# Altium schematic sheet Cameron's Edits.SchDoc: NER A Size Template
size Tabloid; ApprovedBy: WS; DrawnBy: Cameron Gordon & Elise Cooke; Address4: X.X.X; Revision: 1; SheetNumber: 2; SheetTotal: 3
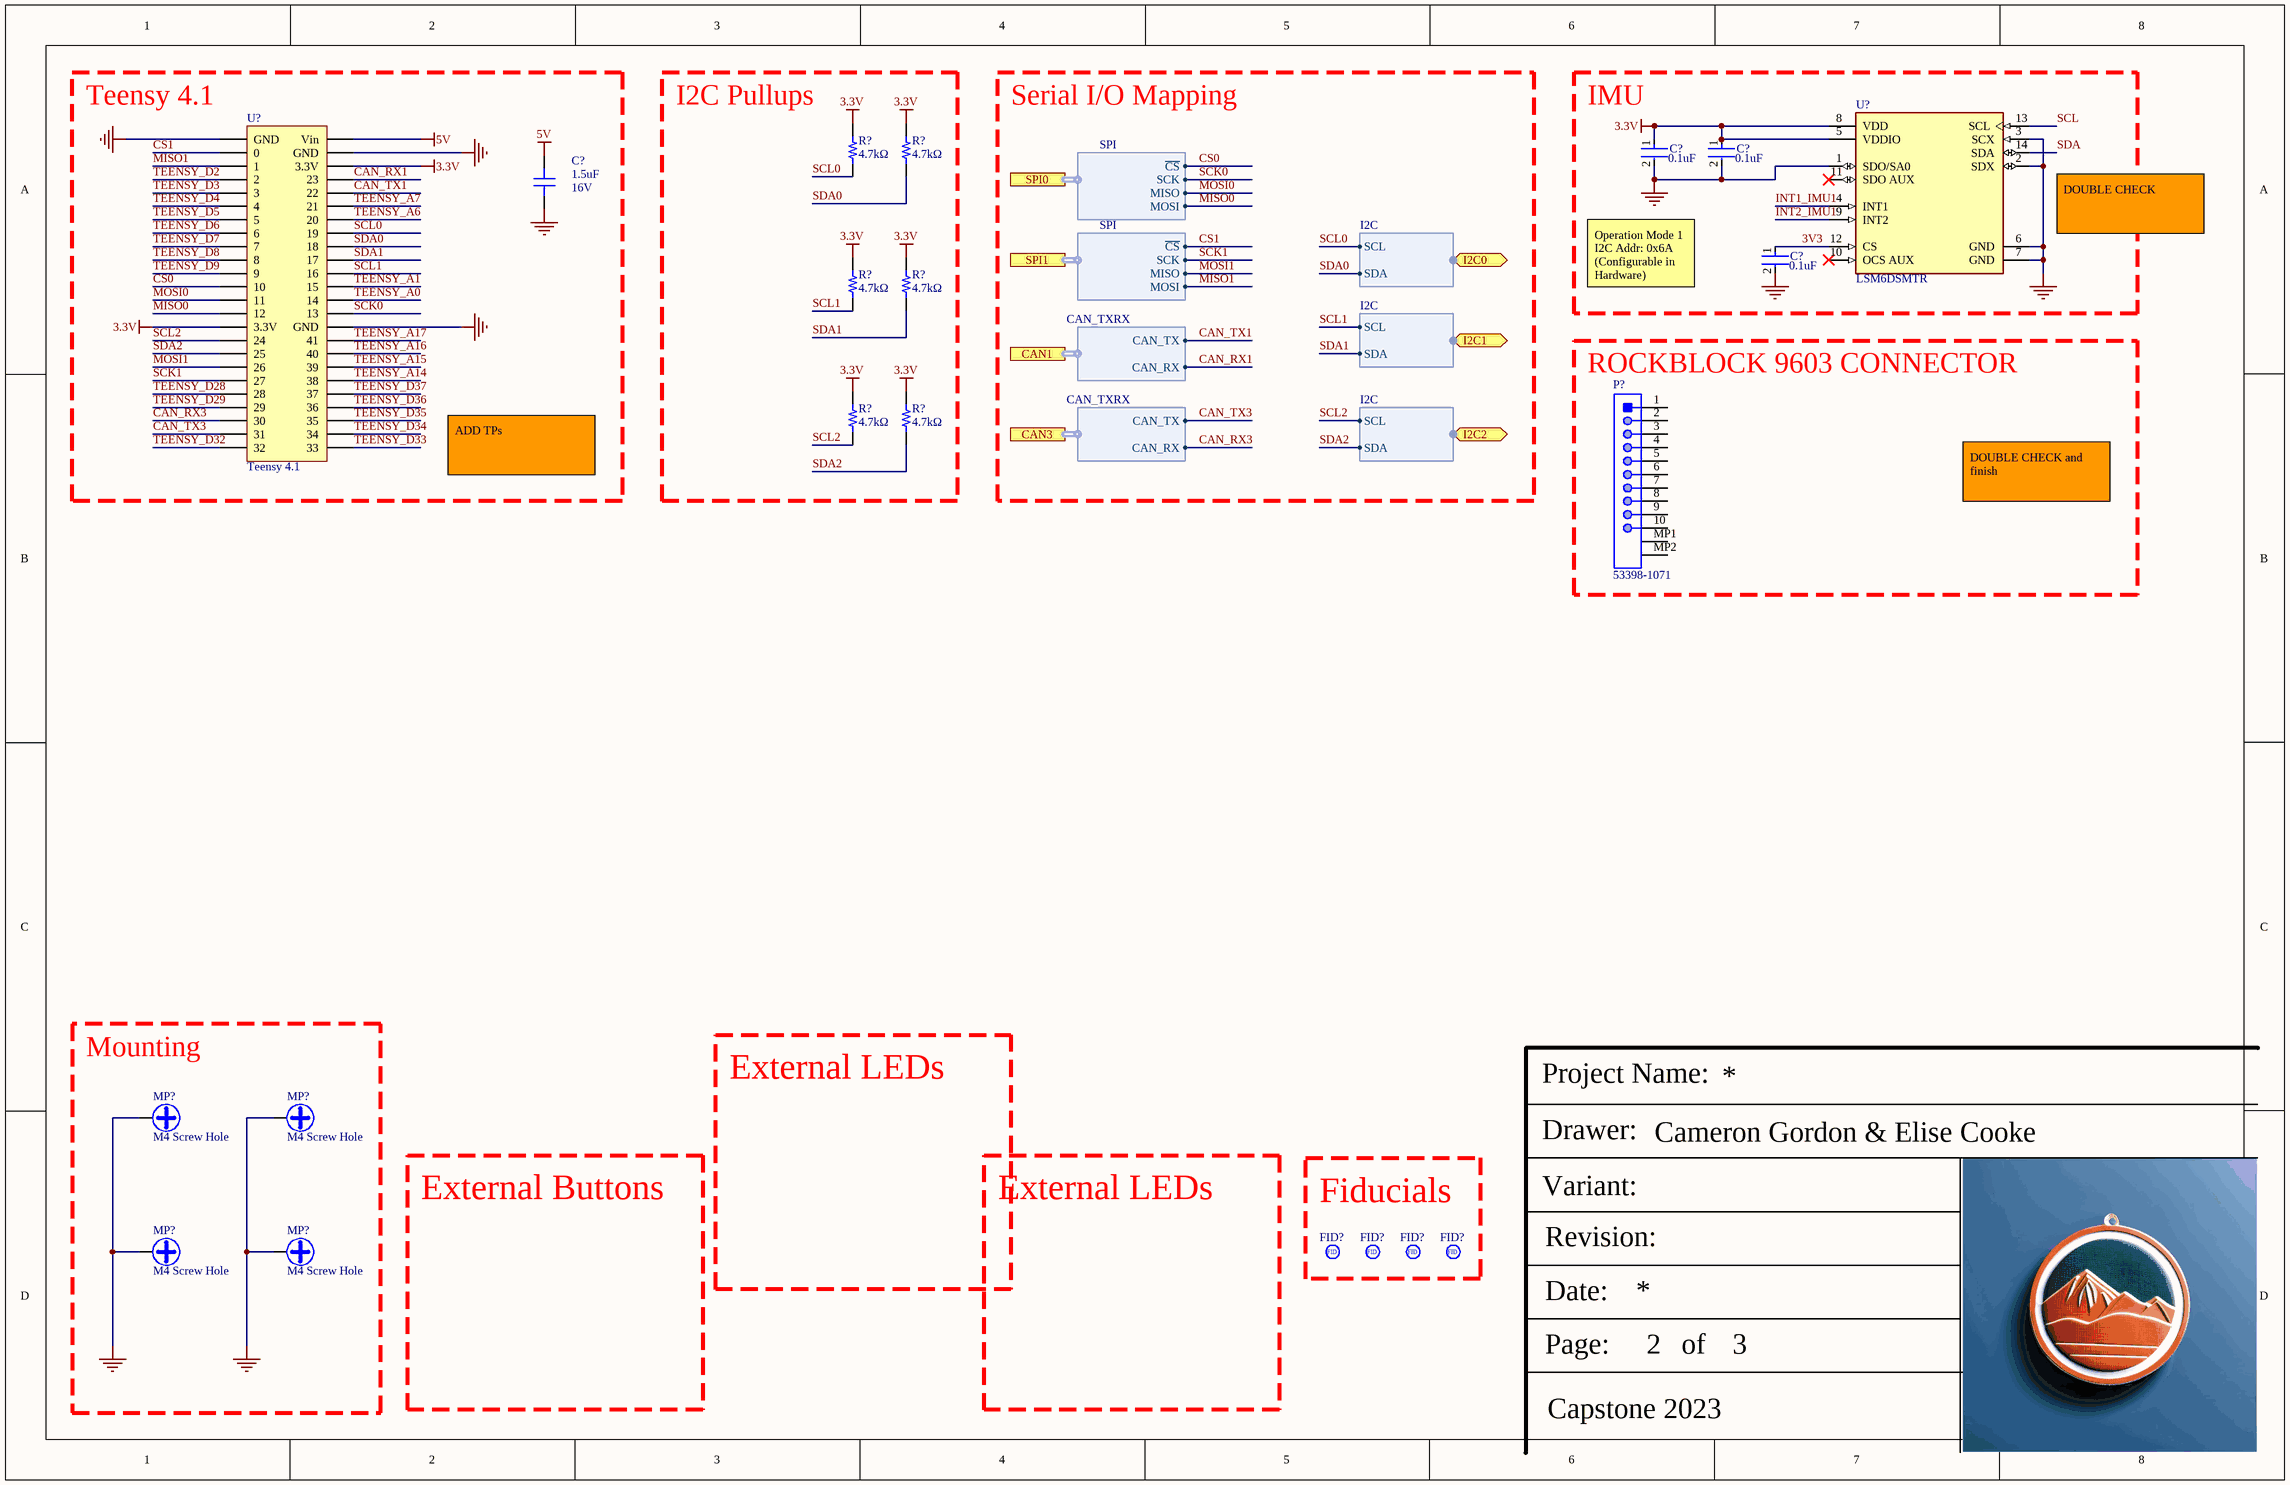
[diagram p0: Cameron's Edits.SchDoc]

## Parts
(Parts that share a designator on the sheet are numbered #1, #2 ... from top to bottom, then left to right.)
C?#1  Capacitance: 0.1uF  [FP-CL278-IPC_C]  (hidden comment: CL05A104KA5NNNC)
C?#2  Capacitance: 0.1uF  [FP-CL278-IPC_C]  (hidden comment: CL05A104KA5NNNC)
C?#3  Capacitance: 1.5uF  Voltage Rating: 16V  [0805 Ceramic Capacitor]  (hidden comment: GCM21BR71C155KA37L)
C?#4  Capacitance: 0.1uF  [FP-CL278-IPC_C]  (hidden comment: CL05A104KA5NNNC)
FID?#1  Fiducial  [40 mil Circular Test Point]  (value not drawn)
FID?#2  Fiducial  [40 mil Circular Test Point]  (value not drawn)
FID?#3  Fiducial  [40 mil Circular Test Point]  (value not drawn)
FID?#4  Fiducial  [40 mil Circular Test Point]  (value not drawn)
MP?#1  M4 Screw Hole  [New footprint 1]
MP?#2  M4 Screw Hole  [New footprint 1]
MP?#3  M4 Screw Hole  [New footprint 1]
MP?#4  M4 Screw Hole  [New footprint 1]
P?  53398-1071  [MOLX-53398-1071_V]
R?#1  Resistance: 4.7kΩ  [0603 Resistor]  (hidden comment: ERJ-3GEYJ472V)
R?#2  Resistance: 4.7kΩ  [0603 Resistor]  (hidden comment: ERJ-3GEYJ472V)
R?#3  Resistance: 4.7kΩ  [0603 Resistor]  (hidden comment: ERJ-3GEYJ472V)
R?#4  Resistance: 4.7kΩ  [0603 Resistor]  (hidden comment: ERJ-3GEYJ472V)
R?#5  Resistance: 4.7kΩ  [0603 Resistor]  (hidden comment: ERJ-3GEYJ472V)
R?#6  Resistance: 4.7kΩ  [0603 Resistor]  (hidden comment: ERJ-3GEYJ472V)
U?#1  LSM6DSMTR  [FP-LGA-14L-DM00249496-MFG]
U?#2  Teensy 4.1  [Teensy_4.1]

## Blocks framed on the sheet
Teensy 4.1: C?#3 U?#2
I2C Pullups: R?#1-R?#6
IMU: C?#1 C?#2 C?#4 U?#1
ROCKBLOCK 9603 CONNECTOR: P?
Mounting: MP?#1-MP?#4
Fiducials: FID?#1-FID?#4

## Ports
CAN1 (harness CAN_TXRX), CAN3 (harness CAN_TXRX), I2C0 (bidir, harness I2C), I2C1 (bidir, harness I2C), I2C2 (bidir, harness I2C), SPI0 (harness SPI), SPI1 (harness SPI)

## Harnesses
SPI: MOSI, MISO, ~{CS}, SCK
CAN_TXRX: CAN_TX, CAN_RX
I2C: SCL, SDA

## Nets
3.3V: C?#1.1 C?#2.1 R?#1.2 R?#2.2 R?#3.2 R?#4.2 R?#5.2 R?#6.2 U?#1.5(VDDIO) U?#1.8(VDD) U?#2.15(3.3V) U?#2.46(3.3V)
5V: C?#3.2 U?#2.48(Vin)
GND: C?#1.2 C?#2.2 C?#3.1 C?#4.2 MP?#1.1 MP?#2.1 MP?#3.1 MP?#4.1 U?#1.1(SDO/SA0) U?#1.2(SDX) U?#1.3(SCX) U?#1.6(GND) U?#1.7(GND) U?#2.1(GND) U?#2.34(GND) U?#2.47(GND)
3V3: C?#4.1 U?#1.12(CS)
CAN_RX1: U?#2.45(23) ; port CAN1.CAN_RX
CAN_RX3: U?#2.22(30) ; port CAN3.CAN_RX
CAN_TX1: U?#2.44(22) ; port CAN1.CAN_TX
CAN_TX3: U?#2.23(31) ; port CAN3.CAN_TX
CS0: U?#2.12(10) ; port SPI0.~{CS}
CS1: U?#2.2(0) ; port SPI1.~{CS}
INT1_IMU1: U?#1.4(INT1)
INT2_IMU1: U?#1.9(INT2)
MISO0: U?#2.14(12) ; port SPI0.MOSI
MISO1: U?#2.3(1) ; port SPI1.MOSI
MOSI0: U?#2.13(11) ; port SPI0.MISO
MOSI1: U?#2.18(26) ; port SPI1.MISO
SCK0: U?#2.35(13) ; port SPI0.SCK
SCK1: U?#2.19(27) ; port SPI1.SCK
SCL: U?#1.13(SCL)
SCL0: R?#1.1 U?#2.41(19) ; port I2C0.SCL
SCL1: R?#3.1 U?#2.38(16) ; port I2C1.SCL
SCL2: R?#5.1 U?#2.16(24) ; port I2C2.SCL
SDA: U?#1.14(SDA)
SDA0: R?#2.1 U?#2.40(18) ; port I2C0.SDA
SDA1: R?#4.1 U?#2.39(17) ; port I2C1.SDA
SDA2: R?#6.1 U?#2.17(25) ; port I2C2.SDA
TEENSY_A0: U?#2.36(14)
TEENSY_A1: U?#2.37(15)
TEENSY_A6: U?#2.42(20)
TEENSY_A7: U?#2.43(21)
TEENSY_A14: U?#2.30(38)
TEENSY_A15: U?#2.31(39)
TEENSY_A16: U?#2.32(40)
TEENSY_A17: U?#2.33(41)
TEENSY_D2: U?#2.4(2)
TEENSY_D3: U?#2.5(3)
TEENSY_D4: U?#2.6(4)
TEENSY_D5: U?#2.7(5)
TEENSY_D6: U?#2.8(6)
TEENSY_D7: U?#2.9(7)
TEENSY_D8: U?#2.10(8)
TEENSY_D9: U?#2.11(9)
TEENSY_D28: U?#2.20(28)
TEENSY_D29: U?#2.21(29)
TEENSY_D32: U?#2.24(32)
TEENSY_D33: U?#2.25(33)
TEENSY_D34: U?#2.26(34)
TEENSY_D35: U?#2.27(35)
TEENSY_D36: U?#2.28(36)
TEENSY_D37: U?#2.29(37)

Not connected (* = marked no-connect by the designer): P? 1 2 3 4 5 6 7 8 9 10 MP1 MP2; U?#1 10(OCS_AUX)* 11(SDO_AUX)*

## Notes on the sheet
- Serial I/O Mapping
- DOUBLE CHECK
- Operation Mode 1
  I2C Addr: 0x6A (Configurable in Hardware)
- ADD TPs
- DOUBLE CHECK and finish
- External LEDs
- External Buttons
- Project Name:
- Drawer:
- Variant:
- Revision:
- Date:
- Page:
- of
- Capstone 2023
- (in symbol CMP-00019-1) FID

## Library data of the parts
C?#1 C?#2 C?#4 = CMP-13271-000728-1: Cap Ceramic 100nF 25V X5R ±10% SMD 0402 +85°C Paper T/R; Package Quantity: 1; Height: 0.5mm; Case Code (Metric): 1005; Thickness: 0.022inch; Mount: Surface Mount; Lead Free: Lead Free; Case Code (Imperial): 0402; Packaging: Tape and Reel; Depth: 0.5mm; Voltage: 25V; Min Operating Temperature: -55°C; Voltage Rating: 25V; Dielectric: X5R; Case/Package: 0402; Tolerance: 10%; Width: 0.02inch; Max Operating Temperature: 85°C; Length: 1mm; Radiation Hardening: No; Voltage Rating (DC): 25V
C?#3 = CMP-001-0067-2: 0805 Ceramic Capacitor, 1.5uF, 16V, X7R; Tolerance: 10%; Package: 0805
FID?#1-FID?#4 = CMP-00019-1
MP?#1-MP?#4 = CMP-00024-1: Plated hole for M4 mounting hardware
P? = CMP-2000-05635-1: Male Header, Pitch 1.25 mm, 1 x 10 Position, Height 4.7 mm, -40 to 85 degC, RoHS, Tape and Reel; Manufacturer: Molex; Mounting Angle: Vertical; Pitch: 1.25mm; Voltage Rating: 125V; Current Rating: 1A; Number of Rows: 1Row; Housing Material: Nylon; Mounting Technology: SurfaceMount; Mounting Style: SMD; Contact Material: PhosphorBronze; Product: Headers; Datasheet URL: http://www.molex.com/pdm_docs/sd/533981071_sd.pdf; Manufacturer URL: http://www.molex.com/; Datasheet Version: Rev. J, 09/2015; Factory Pack Quantity: 1000; Brand: Molex; Packaging: Reel; Product Category: Headers&WireHousings; Contact Gender: Pin(Male); Number of Positions: 10Position; RoHS: Details; Contact Plating: Tin; Package Description: Male Header, Pitch 1.25 mm, 1 x 10 Position, Height 4.7 mm; Series: 53398; Type: Shrouded; Package Reference: 53398-1071; Tradename: PicoBlade; Termination Style: SMD
R?#1-R?#6 = CMP-001-0036-2: 0603 Resistor, 4.7kΩ, ±5%, 0.1W; Power Rating: 100mW; Tolerance: 5%; Package: 0603
U?#1 = CMP-12177-000008-1: IMU ACCEL/GYRO I2C/SPI 14LGA; Manufacturer: STMicroelectronics; Operating Supply Current: 0.29-0.65mA; Gyro Range: 125/250/500/1000/2000°/s; Sensor Output: I2C,SPI; Accel Range: 2/4/8/16g; Min Supply Voltage: 1.62V; Resolution: 16bits; Sensor Type: Temperature,Accelerometer,Gyroscope; Max Supply Voltage: 3.6V; Manufacturer Part Number: LSM6DSMTR; Octopart: https://octopart.com/lsm6dsmtr-stmicroelectronics-66358194; Height: 0.86mm; Category: IC; Lead Free: Yes; Temperature: -40°C to +85°C; Temperature Range Low: -40°C; ComponentLink2Description: Datasheet; ComponentLink2URL: https://www.st.com/resource/en/datasheet/lsm6dsm.pdf; Digikey Description: IMU ACCEL/GYRO I2C/SPI 14LGA; Footprint Url: https://www.st.com/content/ccc/resource/technical/document/technical_note/73/17/9c/16/dd/96/4a/01/CD00134799.pdf/files/CD00134799.pdf/jcr:content/translations/en.CD00134799.pdf; Device Class L1: Sensors; Device Class L2: Motion Sensors; Temperature Range High: +85°C; Mouser Description: LSM6DSM Series 3.6 V I2C/SPI 3D Accelerometer and 3D Gyroscope - LGA-14; Device Class L3: Inertial Measurement Units (IMUs); Automotive: No; Package: LGA-14L-DM00249496; RoHS: TRUE
U?#2 = CMP-00040-2: Teensy 4.1 w/ Headers